# EAGLE design PCB__STM32_APDS9960 (EAGLE 9.6.2)
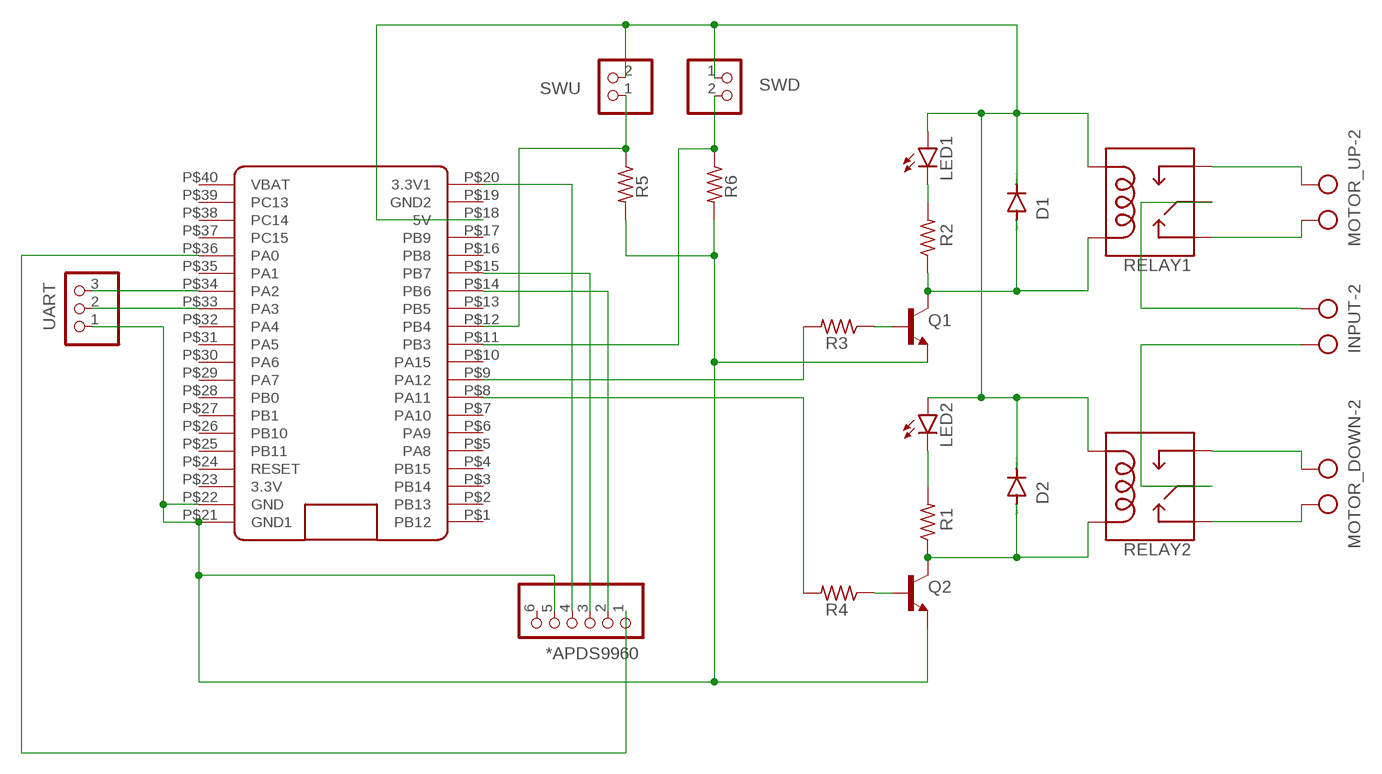
[diagram p0: schematic, sheet 1]

## Parts
*APDS9960  PINHD-1X6  [1X06]
D1  1N4446  [DO35-10]
D2  1N4446  [DO35-10]
INPUT  AK500/2  [AK500/2]
LED1  TLLR4400  [LED3MM]
LED2  TLLR4400  [LED3MM]
MOTOR_DOWN  AK500/2  [AK500/2]
MOTOR_UP  AK500/2  [AK500/2]
Q1  2N3904  [TO92]
Q2  2N3904  [TO92]
R1  R-US_0207/10  [0207/10]
R2  R-US_0207/10  [0207/10]
R3  R-US_0207/10  [0207/10]
R4  R-US_0207/10  [0207/10]
R5  R-US_0207/10  [0207/10]
R6  R-US_0207/10  [0207/10]
RELAY1  RELAYPTH  [SRD-05VDC-SL-C]
RELAY2  RELAYPTH  [SRD-05VDC-SL-C]
SWD  PINHD-1X2  [1X02]
SWU  PINHD-1X2  [1X02]
U$1  BLUE_PILL  [BLUE_PILL]
UART  PINHD-1X3  [1X03]

## Nets
N$1: R5.1 SWU.1 U$1.P$12(PB4)
N$2: R6.1 SWD.2 U$1.P$11(PB3)
N$3: D1.C D2.C LED1.A LED2.A RELAY1.COIL0 RELAY2.COIL0 SWD.1 SWU.2 U$1.P$18(5V)
N$4: R4.2 U$1.P$8(PA11)
N$5: LED2.K(C) R1.2
N$6: D2.A Q2.1(C) R1.1 RELAY2.COIL1
N$7: MOTOR_DOWN.2 RELAY2.SWOPEN
N$8: MOTOR_DOWN.1 RELAY2.SWCLOSED(SWCLOSE)
N$9: INPUT.1 RELAY2.SWCOMMON
N$10: INPUT.2 RELAY1.SWCOMMON
N$11: MOTOR_UP.2 RELAY1.SWOPEN
N$12: MOTOR_UP.1 RELAY1.SWCLOSED(SWCLOSE)
N$13: R3.2 U$1.P$9(PA12)
N$14: LED1.K(C) R2.2
N$15: D1.A Q1.1(C) R2.1 RELAY1.COIL1
N$16: Q2.2(B) R4.1
N$17: Q1.2(B) R3.1
N$18: U$1.P$34(PA2) UART.3
N$19: *APDS9960.4 U$1.P$20(3.3V1)
N$20: U$1.P$33(PA3) UART.2
N$21: *APDS9960.2 U$1.P$14(PB6)
N$22: *APDS9960.1 U$1.P$36(PA0)
N$23: *APDS9960.3 U$1.P$15(PB7)
N$25: *APDS9960.5 Q1.3(E) Q2.3(E) R5.2 R6.2 U$1.P$21(GND1) U$1.P$22(GND) UART.1
Unconnected: *APDS9960.6 U$1.P$1(PB12) U$1.P$2(PB13) U$1.P$3(PB14) U$1.P$4(PB15) U$1.P$5(PA8) U$1.P$6(PA9) U$1.P$7(PA10) U$1.P$10(PA15) U$1.P$13(PB5) U$1.P$16(PB8) U$1.P$17(PB9) U$1.P$19(GND2) U$1.P$23(3.3V) U$1.P$24(RESET) U$1.P$25(PB11) U$1.P$26(PB10) U$1.P$27(PB1) U$1.P$28(PB0) U$1.P$29(PA7) U$1.P$30(PA6) U$1.P$31(PA5) U$1.P$32(PA4) U$1.P$35(PA1) U$1.P$37(PC15) U$1.P$38(PC14) U$1.P$39(PC13) U$1.P$40(VBAT)

## Library data of the parts
*APDS9960 = pinhead:PINHD-1X6: PIN HEADER
D1 D2 = diode:1N4446: DIODE high speed (Philips)
INPUT MOTOR_DOWN MOTOR_UP = con-ptr500:AK500/2: CONNECTOR; OC_FARNELL: unknown; OC_NEWARK: unknown
LED1 LED2 = led:TLLR4400: Low Current (2mA) LED 3 mm Tinted Diffused Package color RED Source: Data sheet <http://www.farnell.com/datasheets/391100.pdf>; MF: VISHAY SEMICONDUCTOR; OC_FARNELL: 1612437
Q1 Q2 = transistor-npn:2N3904: NPN Transistor
R1-R6 = rcl:R-US_: RESISTOR, American symbol; SPICEPREFIX: R
RELAY1 RELAY2 = SRD-05VDC-SL-C:RELAY: SPDT relay (COM-00101)
SWD SWU = pinhead:PINHD-1X2: PIN HEADER
U$1 = BluePill:BLUE_PILL
UART = pinhead:PINHD-1X3: PIN HEADER

## Board
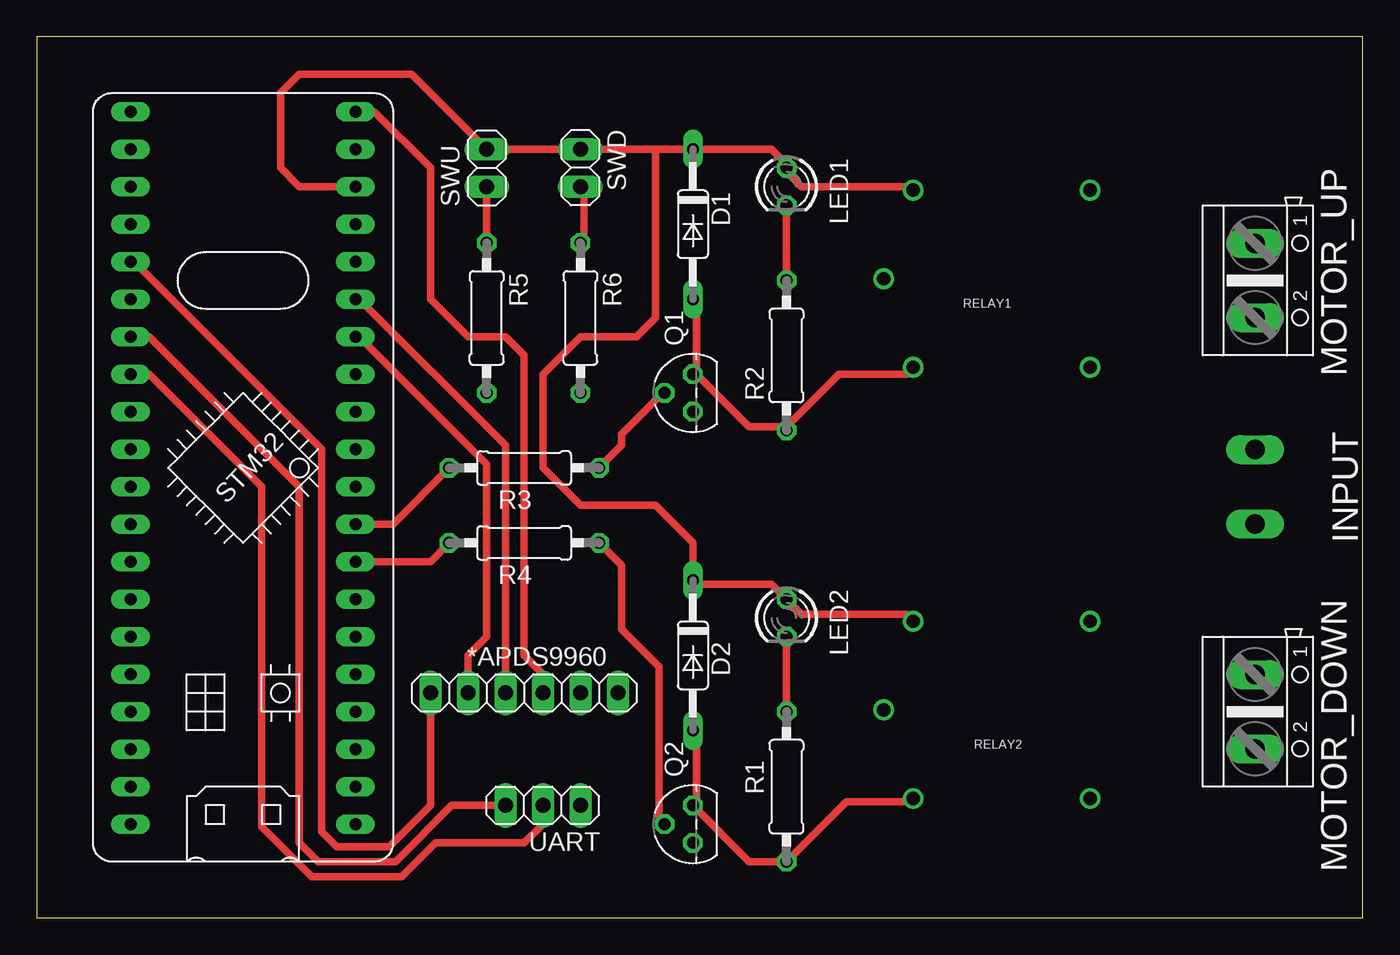
[diagram p1: board, top side]
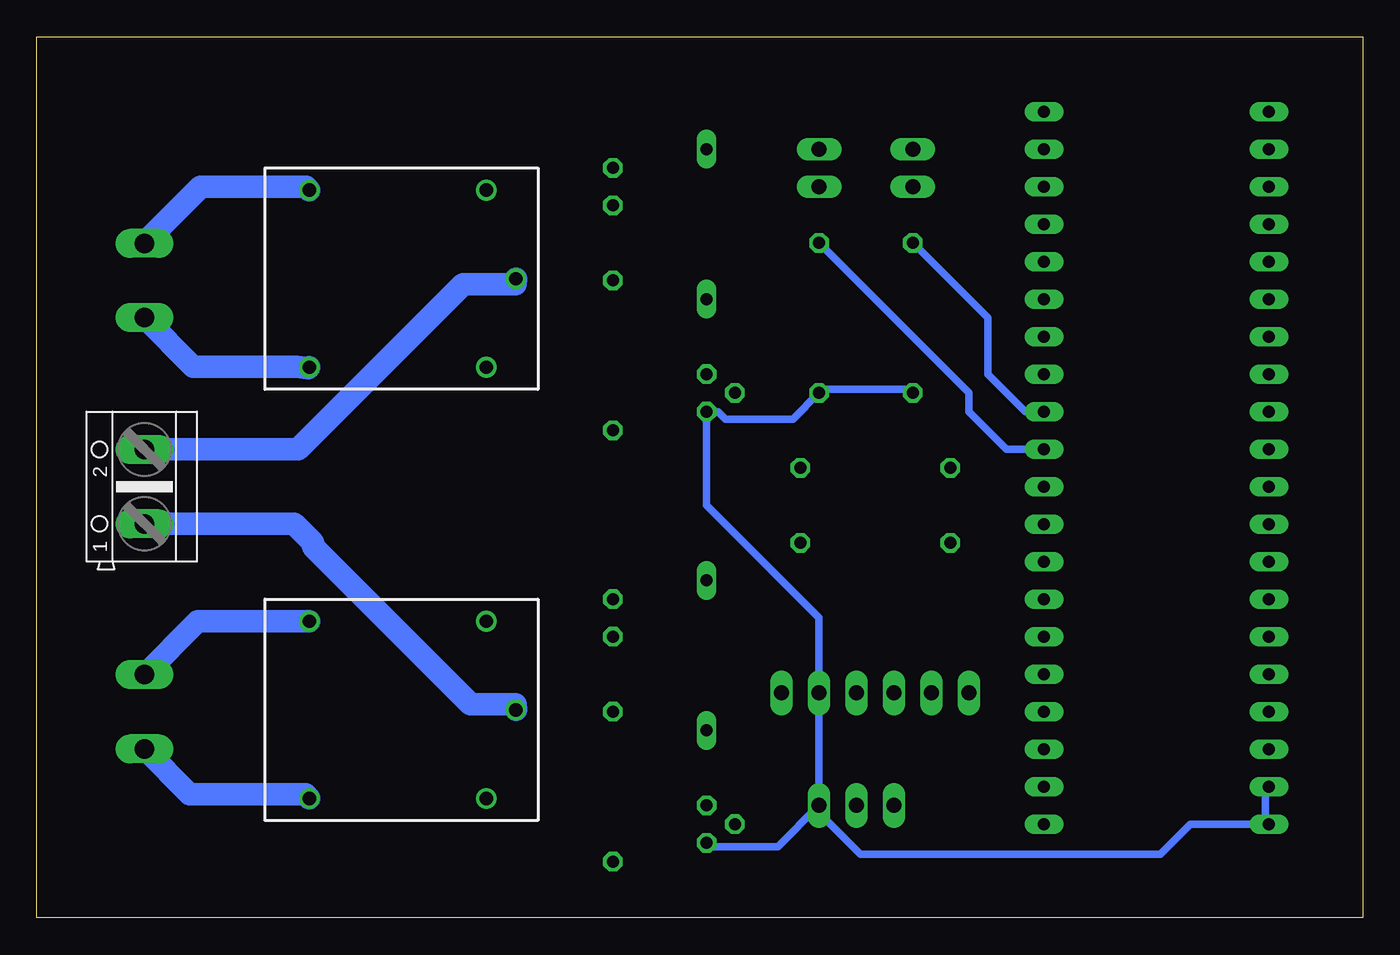
[diagram p2: board, bottom side, seen from below]

Size 89.84 x 59.68 mm. Coordinates in mm from the lower left corner, seen from the top.
Outline: 0,0 89.84,0 89.84,59.68 0,59.68 0,0
Copper layers (1*16): Top 0.06mm / dielectric 1.5mm / Bottom 0.06mm
Design rules "Pedro": minimum track width 20mil, minimum drill 0.35mm, track to track 20mil, track to pad 20mil, pad to pad 20mil, via to via 20mil, smd to smd 20mil, copper to edge 35mil, drill to drill 6mil, minimum pad ring 10mil, minimum via ring 8mil, stop-mask expansion 4mil, vias tented up to drill 0mil, thermal gap 10mil

### Footprints (pad centres in the part's own frame; a part is rotated, then mirrored left to right if it is on the bottom)
1X06 = drill 1.016 long: 1 -6.35,0; 2 -3.81,0; 3 -1.27,0; 4 1.27,0; 5 3.81,0; 6 6.35,0
DO35-10 = drill 0.813 long: A 5.08,0; C -5.08,0
AK500/2 = drill 1.321 long: 1 -2.515,0; 2 2.515,0
LED3MM = drill 0.813 octagon: A -1.27,0; K 1.27,0
TO92 = drill 0.813 octagon: 1 1.27,0; 2 0,1.905; 3 -1.27,0
0207/10 = drill 0.813 octagon: 1 -5.08,0; 2 5.08,0
SRD-05VDC-SL-C = drill 0.9: COIL0 -5.39,-6.12; COIL1 -5.39,5.88; SWCLOSED 6.61,-6.12; SWCOMMON -7.39,-0.12; SWOPEN 6.61,5.88
1X02 = drill 1.016 long: 1 -1.27,0; 2 1.27,0
BLUE_PILL = drill 0.8 long: P$1 -7.62,15.24; P$2 -7.62,12.7; P$3 -7.62,10.16; P$4 -7.62,7.62; P$5 -7.62,5.08; P$6 -7.62,2.54; P$7 -7.62,0; P$8 -7.62,-2.54; P$9 -7.62,-5.08; P$10 -7.62,-7.62; P$11 -7.62,-10.16; P$12 -7.62,-12.7; P$13 -7.62,-15.24; P$14 -7.62,-17.78; P$15 -7.62,-20.32; P$16 -7.62,-22.86; P$17 -7.62,-25.4; P$18 -7.62,-27.94; P$19 -7.62,-30.48; P$20 -7.62,-33.02; P$21 7.62,15.24; P$22 7.62,12.7; P$23 7.62,10.16; P$24 7.62,7.62; P$25 7.62,5.08; P$26 7.62,2.54; P$27 7.62,0; P$28 7.62,-2.54; P$29 7.62,-5.08; P$30 7.62,-7.62; P$31 7.62,-10.16; P$32 7.62,-12.7; P$33 7.62,-15.24; P$34 7.62,-17.78; P$35 7.62,-20.32; P$36 7.62,-22.86; P$37 7.62,-25.4; P$38 7.62,-27.94; P$39 7.62,-30.48; P$40 7.62,-33.02
1X03 = drill 1.016 long: 1 -2.54,0; 2 0,0; 3 2.54,0

### Placement (x,y rotation side)
*APDS9960  33.02,15.24 0 top
D1  44.45,46.99 270 top
D2  44.45,17.78 270 top
INPUT  82.55,29.21 90 bottom
LED1  50.8,49.53 270 top
LED2  50.8,20.32 270 top
MOTOR_DOWN  82.55,13.97 270 top
MOTOR_UP  82.55,43.18 270 top
Q1  44.45,35.56 90 top
Q2  44.45,6.35 90 top
R1  50.8,8.89 90 top
R2  50.8,38.1 90 top
R3  33.02,30.48 180 top
R4  33.02,25.4 180 top
R5  30.48,40.64 270 top
R6  36.83,40.64 270 top
RELAY1  64.77,43.18 180 bottom
RELAY2  64.77,13.97 180 bottom
SWD  36.83,50.8 270 top
SWU  30.48,50.8 90 top
U$1  13.97,21.59 180 top
UART  34.29,7.62 180 top

### Tracks (layer width: path | path; a pad name or v marks a point on that pad's centre or on a via)
N$1
  Top 0.508: R5.1 SWU.1
  Bottom 0.508: R5.1 25.4,40.64 25.4,36.83 22.86,34.29 U$1.P$12
N$2
  Top 0.508: SWD.2 37.08,49.53 37.08,45.97 R6.1
  Bottom 0.508: U$1.P$11 24.13,31.75 26.67,34.29 26.67,35.56 R6.1
N$3
  Top 0.508: RELAY2.COIL0 58.93,20.57 51.82,20.57 LED2.A 49.78,22.61 44.7,22.61 D2.C 44.45,25.4 41.91,27.94 36.83,27.94 34.29,30.48 34.29,36.83 36.83,39.37 40.64,39.37 41.91,40.64 41.91,52.07 | 41.91,52.07 D1.C 49.78,52.07 50.8,51.05 LED1.A 50.8,50.55 51.82,49.53 58.93,49.53 59.16,49.3 RELAY1.COIL0 | 41.91,52.07 SWD.1 SWU.2 25.4,57.15 17.78,57.15 16.51,55.88 16.51,50.8 17.78,49.53 U$1.P$18
N$4
  Top 0.508: U$1.P$8 26.67,24.13 R4.2
N$5
  Top 0.508: LED2.K R1.2
N$6
  Top 0.508: D2.A 44.7,12.45 44.7,7.87 Q2.1 48.26,3.81 R1.1 54.86,7.87 58.93,7.87 RELAY2.COIL1
N$7
  Bottom 1.524: RELAY2.SWOPEN 71.63,8.38 79.48,8.38 MOTOR_DOWN.2
N$8
  Bottom 1.524: RELAY2.SWCLOSED 78.94,20.09 MOTOR_DOWN.1
N$9
  Bottom 1.524: RELAY2.SWCOMMON 57.4,14.48 60.45,14.48 71.12,25.15 71.12,25.4 72.41,26.7 INPUT.1
N$10
  Bottom 1.524: RELAY1.SWCOMMON 57.4,42.93 60.96,42.93 72.14,31.75 82.52,31.75 INPUT.2
N$11
  Bottom 1.524: RELAY1.SWOPEN 71.46,37.22 72.23,37.34 79.25,37.34 82.55,40.64 MOTOR_UP.2
N$12
  Bottom 1.524: RELAY1.SWCLOSED 71.61,49.53 78.74,49.53 82.55,45.72 MOTOR_UP.1
N$13
  Top 0.508: U$1.P$9 24.13,26.67 R3.2
N$14
  Top 0.508: LED1.K R2.2
N$15
  Top 0.508: 50.8,33.27 48.26,33.27 44.7,36.83 | 44.7,36.83 44.7,41.91 D1.A | 44.7,36.83 Q1.1 | 50.8,33.27 54.36,36.83 58.93,36.83 RELAY1.COIL1 | 50.8,33.27 R2.1
N$16
  Top 0.508: R4.1 39.62,23.88 39.62,19.56 42.16,17.02 42.16,6.35 Q2.2
N$17
  Top 0.508: R3.1 39.62,32 39.62,32.77 42.16,35.31 Q1.2
N$18
  Top 0.508: U$1.P$34 7.62,39.37 17.78,29.21 17.78,5.08 19.05,3.81 24.3,3.81 28.11,7.62 UART.3
N$19
  Top 0.508: U$1.P$20 22.86,54.61 26.67,50.8 26.67,41.91 29.21,39.37 31.75,39.37 33.02,38.1 33.02,17.78 34.29,16.51 *APDS9960.4
N$20
  Top 0.508: UART.2 34.29,6.35 33.02,5.08 27,5.08 24.72,2.79 19.05,2.79 18.63,2.79 15.24,6.18 15.24,29.21 7.62,36.83 U$1.P$33
N$21
  Top 0.508: U$1.P$14 21.84,39.37 30.48,30.73 30.48,19.05 29.21,17.78 *APDS9960.2
N$22
  Top 0.508: U$1.P$36 6.6,44.45 19.3,31.75 19.3,5.84 20.32,4.83 23.88,4.83 26.67,7.62 *APDS9960.1
N$23
  Top 0.508: U$1.P$15 21.84,41.91 31.75,32 31.75,15.49 31.88,15.37 *APDS9960.3
N$25
  Bottom 0.508: R5.2 30.48,35.81 36.58,35.81 R6.2 38.61,33.78 43.18,33.78 43.69,34.29 Q1.3 44.45,27.94 36.83,20.32 *APDS9960.5 UART.1 | 6.6,6.35 6.6,8.89 U$1.P$22 | Q2.3 44.2,4.83 39.62,4.83 UART.1 | 6.6,6.35 11.68,6.35 13.72,4.32 34.04,4.32 36.83,7.11 UART.1 | 6.6,6.35 U$1.P$21